# Altium schematic sheet Block Diagram.SchDoc: OTG PUCK
size B; DrawnBy: KEW; RevisionEngineer: KEW; ProjectTitle: OTG PUCK; Revision: X2; SheetNumber: 1; SheetTotal: 5; RevisionDescription: Initial; DrawnByDate: 10/18/2022; ProjectNumber: TBD; AssemblyNumber: 7150-XXXX; RevisionDate: 10/18/2022; SheetTitle: Block Diagram; Date: 10/18/2022; ApprovedBy: KEW; CheckedBy: KEW; Author: KEW; CompanyName: Gamber-Johnson LLC.; Engineer: KEW; Organization: Gamber-Johnson LLC.; Address1: 5001 Joerns Dr.; Address2: Stevens Point; Address3: WI, 54481; DocumentNumber: TBD; Application_BuildNumber: TBD; Time: 9:29AM
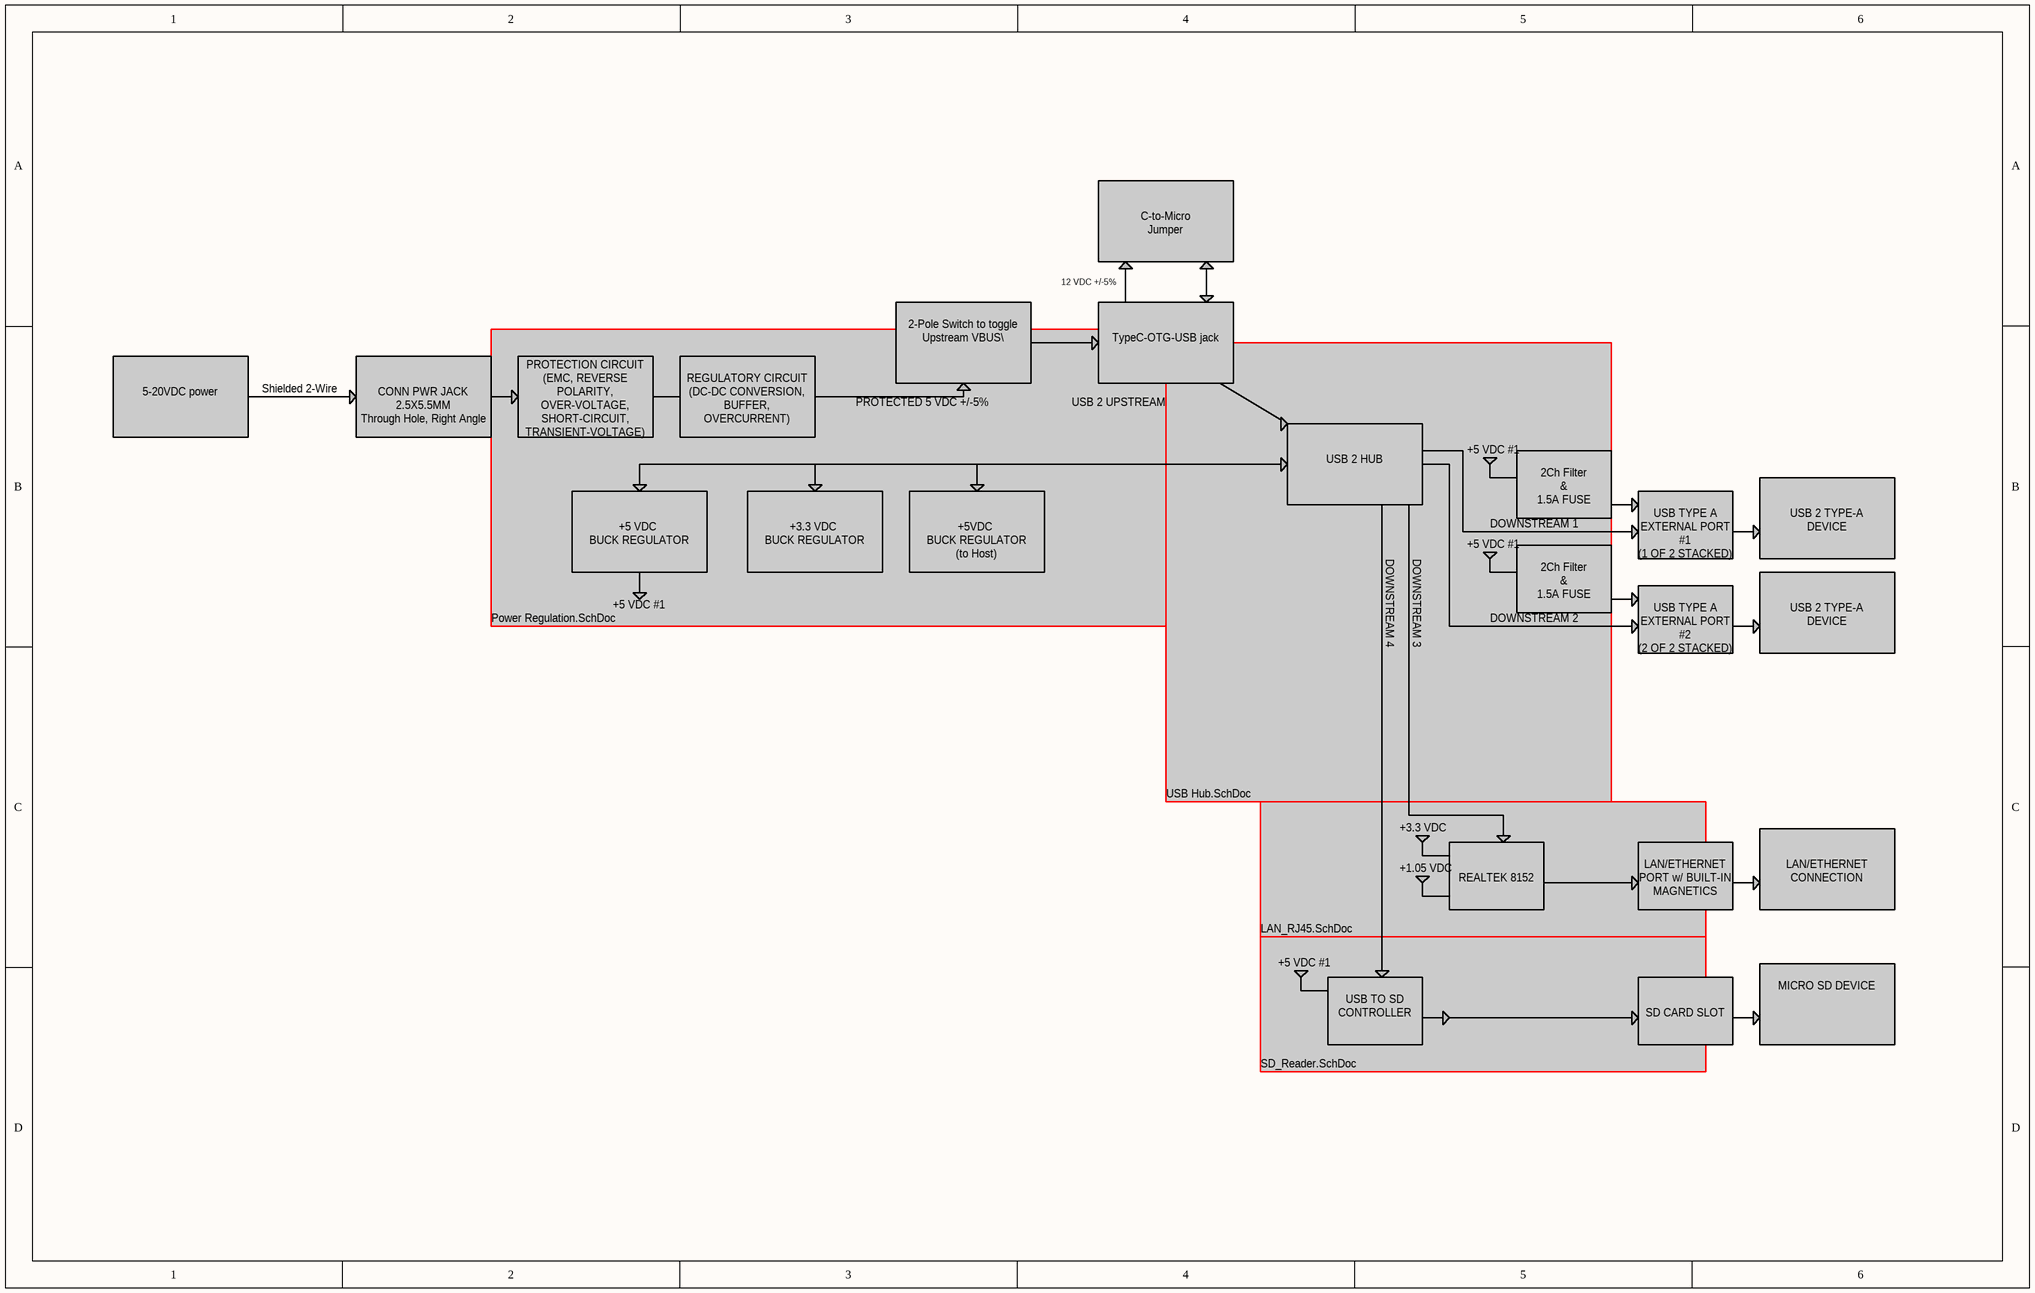
[diagram p0: Block Diagram.SchDoc]

## Sub-sheets
12VDC, 5VDC, 5VDC. 3VDC, 1.2VDC = Power Regulation.SchDoc: no entries
12VDC, 5VDC, 5VDC. 3VDC, 1.2VDC = USB Hub.SchDoc: no entries
12VDC, 5VDC, 5VDC. 3VDC, 1.2VDC = LAN_RJ45.SchDoc: no entries
12VDC, 5VDC, 5VDC. 3VDC, 1.2VDC = SD_Reader.SchDoc: no entries

## Notes on the sheet
- 12 VDC +/-5%
- C-to-Micro
  Jumper
- 5-20VDC power
- Shielded 2-Wire
- CONN PWR JACK 2.5X5.5MM
  Through Hole, Right Angle
- PROTECTION CIRCUIT
  (EMC, REVERSE POLARITY, OVER-VOLTAGE, SHORT-CIRCUIT, TRANSIENT-VOLTAGE)
- REGULATORY CIRCUIT
  (DC-DC CONVERSION,
  BUFFER, OVERCURRENT)
- PROTECTED 5 VDC +/-5%
- 2-Pole Switch to toggle Upstream VBUS\
- USB 2 UPSTREAM
- TypeC-OTG-USB jack
- USB 2 HUB
- +5 VDC #1
- +5 VDC
  BUCK REGULATOR
- +3.3 VDC
  BUCK REGULATOR
- +5VDC
  BUCK REGULATOR
  (to Host)
- DOWNSTREAM 4
- DOWNSTREAM 3
- DOWNSTREAM 1
- 2Ch Filter
  &
  1.5A FUSE
- USB TYPE A
  EXTERNAL PORT #1
  (1 OF 2 STACKED)
- USB 2 TYPE-A
  DEVICE
- DOWNSTREAM 2
- USB TYPE A
  EXTERNAL PORT #2
  (2 OF 2 STACKED)
- +3.3 VDC
- +1.05 VDC
- REALTEK 8152
- LAN/ETHERNET PORT w/ BUILT-IN MAGNETICS
- LAN/ETHERNET CONNECTION
- USB TO SD CONTROLLER
- SD CARD SLOT
- MICRO SD DEVICE
- REV
- REVISIONS
- DATE
- DESCRIPTION
- BY
- UNLESS OTHERWISE SPECIFIED, DRAWING DEFINITIONS AND TOLERANCES SHALL BE FOUND UNDER SUPPLIER STANDARDS SS-001. THIS PART AND ALL COMPONENTS OF IT MUST BE RoHS & REACH COMPLIANT. A CERTIFICATE OF COMPLIANCE MUST BE PROVIDED UPON REQUEST.
- ALL INFORMATION ON THIS DOCUMENT IS THE SOLE PROPERTY OF GAMBER-JOHNSON AND SHALL NOT BE COPIED, REPRODUCED, USED OR DISCLOSED IN WHOLE OR IN PART WITHOUT THE WRITTEN CONSENT OF GAMBER-JOHNSON
- TOLERANCES
  .00 ± .060
  .000 ± .020
  .0000 ± .005
  ANGELS ± 1°
- DRAWN BY:
- PROJECT NUMBER:
- SHEET TITLE:
- SHEET
- OF
- DATE:
- LOCATION:
- ASSEMBLY NUMBER
- SIZE
- GAMBER-JOHNSON LLC
  5001 JOERNS DR.
  STEVENS POINT, WI 54481
  +1 (715) 344-5209
- B